# Altium schematic sheet LPF.SchDoc
size A; SheetNumber: 3; SheetTotal: 11
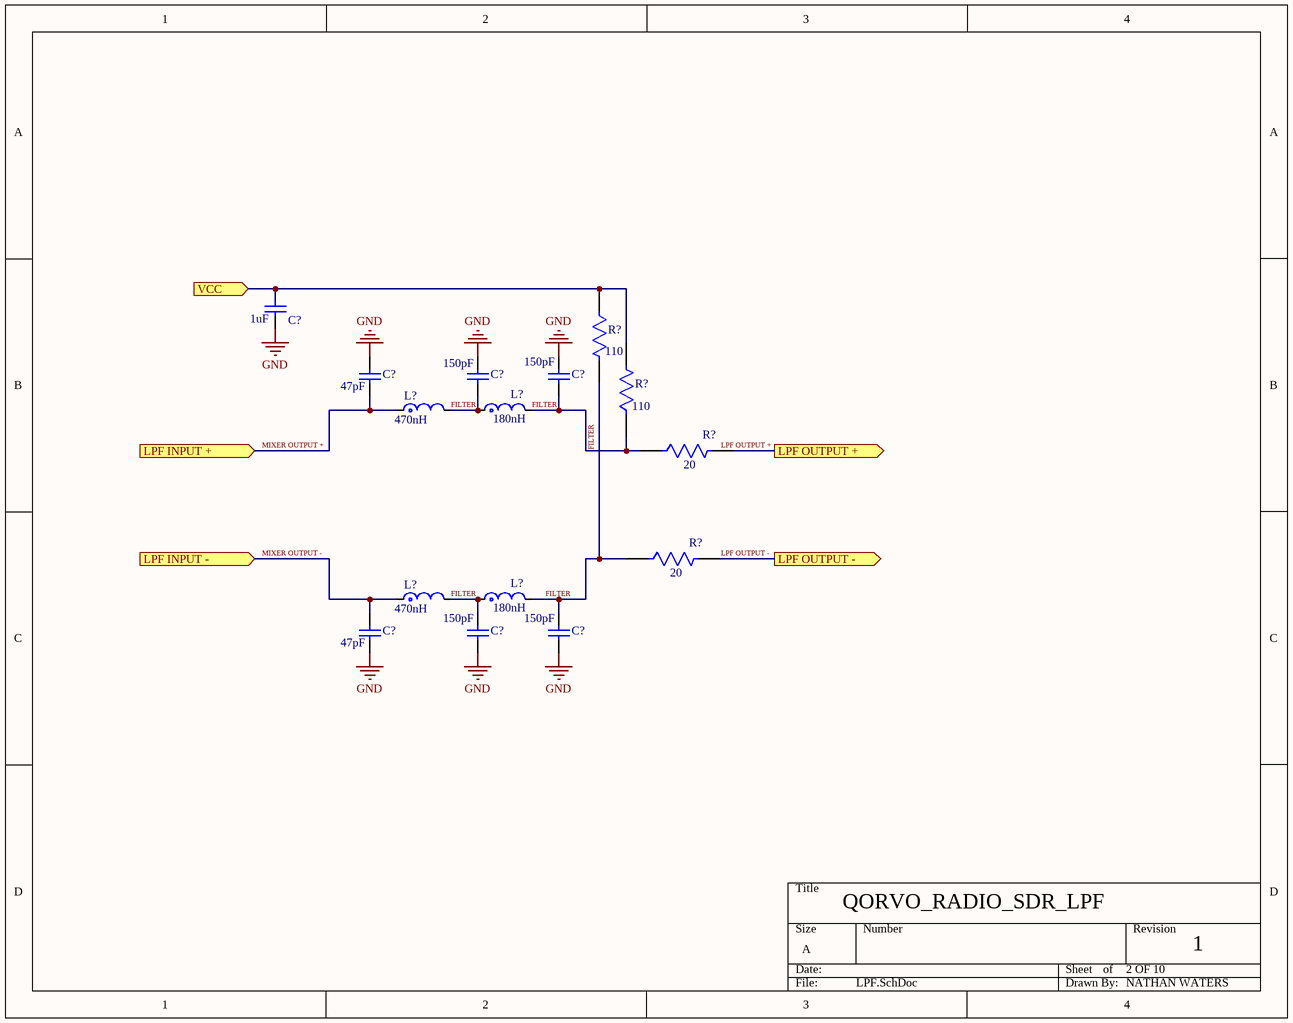
[diagram p0: LPF.SchDoc]

## Parts
(Parts that share a designator on the sheet are numbered #1, #2 ... from top to bottom, then left to right.)
C?#1  CAPACITANCE: 1uF  [0402 CAP_IND_RES]  (hidden comment: GRM155R61H105KE05D)
C?#2  CAPACITANCE: 47pF  [0402 CAP_IND_RES]  (hidden comment: GJM1555C1H470FB01D)
C?#3  CAPACITANCE: 150pF  [0603_CAP]  (hidden comment: VJ0603D151JXXQJHT)
C?#4  CAPACITANCE: 150pF  [0603_CAP]  (hidden comment: VJ0603D151JXXQJHT)
C?#5  CAPACITANCE: 47pF  [0402 CAP_IND_RES]  (hidden comment: GJM1555C1H470FB01D)
C?#6  CAPACITANCE: 150pF  [0603_CAP]  (hidden comment: VJ0603D151JXXQJHT)
C?#7  CAPACITANCE: 150pF  [0603_CAP]  (hidden comment: VJ0603D151JXXQJHT)
L?#1  INDUCTANCE: 470nH  [0402 CAP_IND_RES]  (hidden comment: MHQ1005PR47GT000)
L?#2  INDUCTANCE: 180nH  [0402 CAP_IND_RES]  (hidden comment: MHQ1005PR18GT000)
L?#3  INDUCTANCE: 470nH  [0402 CAP_IND_RES]  (hidden comment: MHQ1005PR47GT000)
L?#4  INDUCTANCE: 180nH  [0402 CAP_IND_RES]  (hidden comment: MHQ1005PR18GT000)
R?#1  RESISTANCE: 110  [0402 CAP_IND_RES]  (hidden comment: CRCW0402110RFKED)
R?#2  RESISTANCE: 110  [0402 CAP_IND_RES]  (hidden comment: CRCW0402110RFKED)
R?#3  RESISTANCE: 20  [0402 CAP_IND_RES]  (hidden comment: CRCW040220R0FKED)
R?#4  RESISTANCE: 20  [0402 CAP_IND_RES]  (hidden comment: CRCW040220R0FKED)

## Ports
LPF INPUT + (in, see HE Mixer[2A], HE Mixer[3A], LE Mixer[2A], LE Mixer[3A]), LPF INPUT - (in, see HE Mixer[2A], HE Mixer[3A], LE Mixer[2A], LE Mixer[3A]), LPF OUTPUT + (out, see AA[1B]), LPF OUTPUT - (out, see AA[1B]), VCC (in, see 0.9V REG[3B], 3.3v REG[3B], AA[1B], AA[2B], HE LNA[3A], HE Mixer[3C], LE LNA[3A], LE Mixer[3C], SWITCH[3B])

## Nets
GND: C?#1.1 C?#2.2 C?#3.2 C?#4.2 C?#5.1 C?#6.1 C?#7.1
FILTER: C?#3.1 C?#4.1 C?#6.2 C?#7.2 L?#1.2 L?#2.1 L?#2.2 L?#3.2 L?#4.1 L?#4.2 R?#1.2 R?#2.1 R?#3.1 R?#4.1
LPF OUTPUT +: R?#3.2 ; port LPF OUTPUT +
LPF OUTPUT -: R?#4.2 ; port LPF OUTPUT -
MIXER OUTPUT +: C?#2.1 L?#1.1 ; port LPF INPUT +
MIXER OUTPUT -: C?#5.2 L?#3.1 ; port LPF INPUT -
VCC: C?#1.2 R?#1.1 R?#2.2 ; port VCC

## Notes on the sheet
- QORVO_RADIO_SDR_LPF
- 2 OF 10
- 1
- NATHAN WATERS
- Labels drawn without touching a wire or pin: LPF OUTPUT +

## Library data of the parts
C?#1 C?#2 C?#5 = 0402_CAP: CAPACITOR
C?#3 C?#4 C?#6 C?#7 = 0603_CAP: CAPACITOR
L?#1-L?#4 = 0402_IND: INDUCTOR
R?#1-R?#4 = 0402_RES: RESISTOR